# EAGLE design LED_Strip (EAGLE 9.4.1)
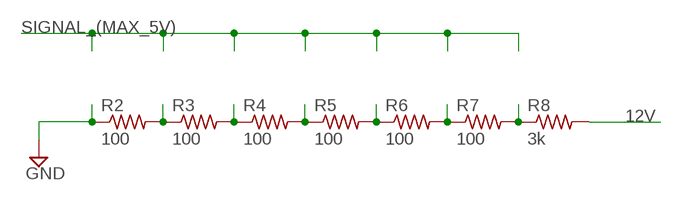
[diagram p0: schematic, sheet 1]

## Parts
R2  100  R-US_R0603  [R0603]
R3  100  R-US_R0603  [R0603]
R4  100  R-US_R0603  [R0603]
R5  100  R-US_R0603  [R0603]
R6  100  R-US_R0603  [R0603]
R7  100  R-US_R0603  [R0603]
R8  3k  R-US_R0603  [R0603]

## Nets
12V: R8.2
GND: R2.1
N$5: R7.2 R8.1
N$6: R6.2 R7.1
N$7: R5.2 R6.1
N$8: R4.2 R5.1
N$9: R3.2 R4.1
N$10: R2.2 R3.1

## Library data of the parts
R2-R8 = rcl:R-US_: RESISTOR, American symbol; SPICEPREFIX: R

## Board
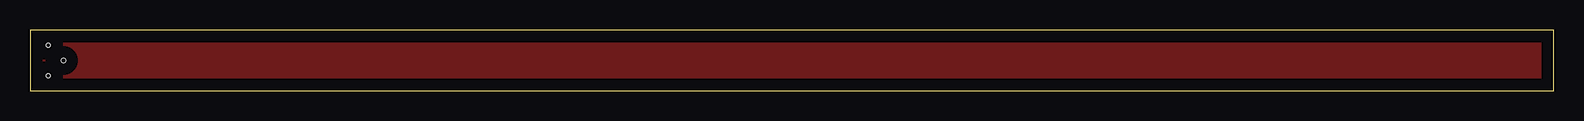
[diagram p1: board, top side]

Size 127 x 5.08 mm. Coordinates in mm from the lower left corner, seen from the top.
Outline: 0,0 127,0 127,5.08 0,5.08 0,0
Copper layers (1*16): Top 0.035mm / dielectric 1.5mm / Bottom 0.035mm
Design rules "default": minimum track width 6mil, minimum drill 0.35mm, track to track 6mil, track to pad 6mil, pad to pad 6mil, via to via 6mil, smd to smd 6mil, copper to edge 40mil, drill to drill 6mil, minimum pad ring 10mil, minimum via ring 8mil, stop-mask expansion 4mil, vias tented up to drill 0mil, thermal gap 10mil
Holes 0.35 mm at 1.52,3.81 1.52,1.27 2.79,2.54

### Footprints (pad centres in the part's own frame; a part is rotated, then mirrored left to right if it is on the bottom)
R0603 = smd 1 x 1.1: 1 -0.85,0; 2 0.85,0

### Placement (x,y rotation side)
R2  4.83,10.67 180 top  (outside the outline)
R3  12.95,16 0 top  (outside the outline)
R4  7.87,16 0 top  (outside the outline)
R5  2.79,16 0 top  (outside the outline)
R6  12.95,21.08 0 top  (outside the outline)
R7  7.87,21.08 0 top  (outside the outline)
R8  4.06,21.08 0 top  (outside the outline)

### Tracks (layer width: path | path; a pad name or v marks a point on that pad's centre or on a via)
N$5  (1 unrouted)
N$6  (1 unrouted)
N$7  (1 unrouted)
N$8  (1 unrouted)
N$9  (1 unrouted)
N$10  (1 unrouted)
SIGNAL_(MAX_5V)
  pour Top: 0,5.08 0,0 127,0 127,5.08